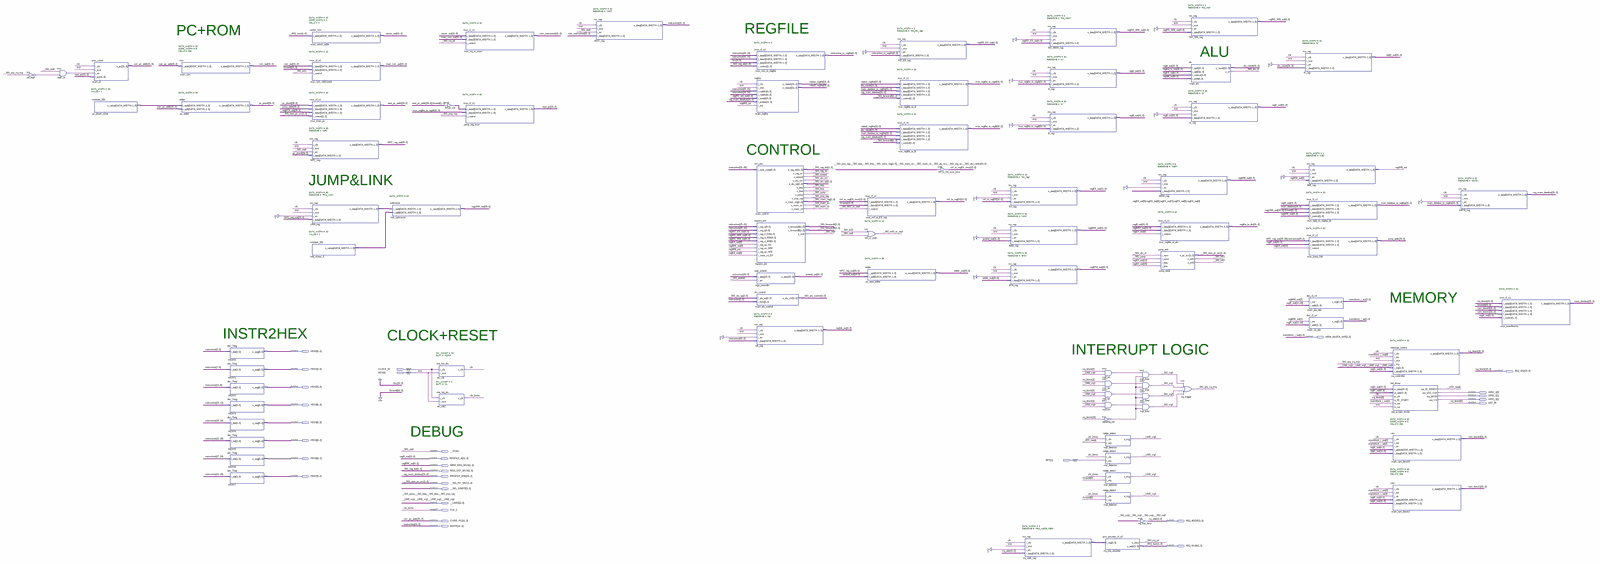
[diagram p0: schematic sheet, whole]
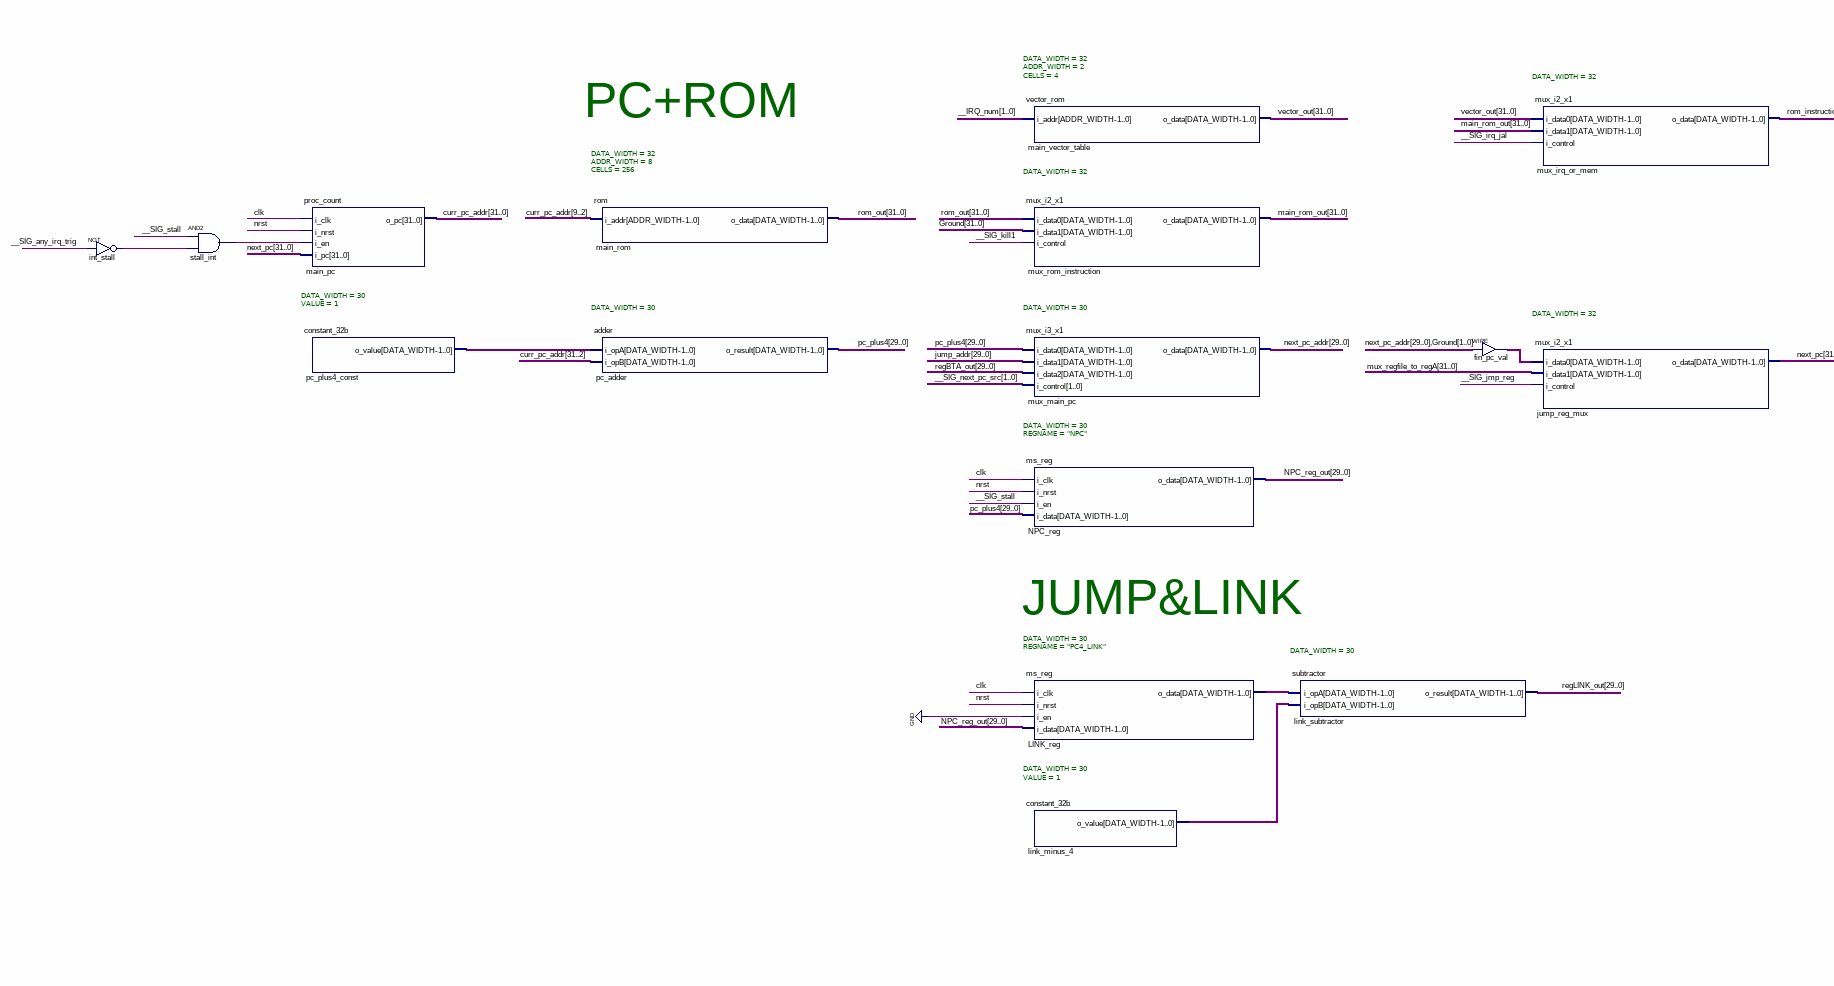
[diagram p1: schematic sheet, upper left part]
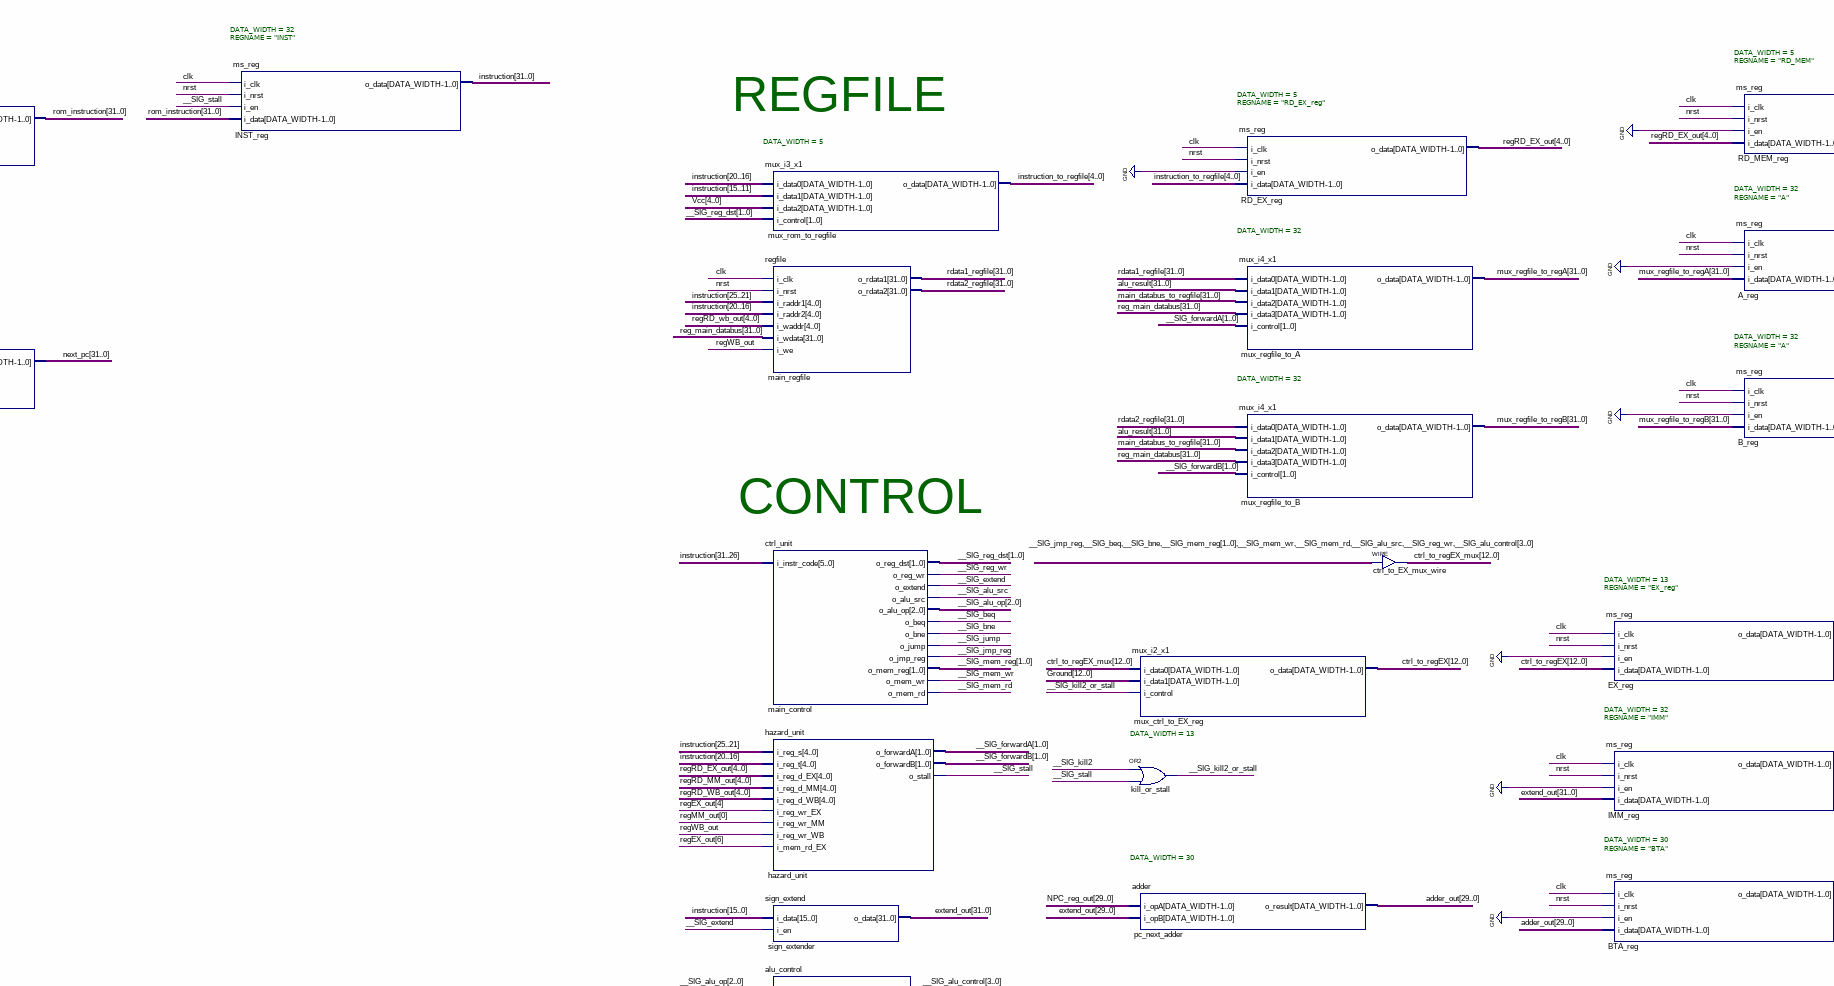
[diagram p2: schematic sheet, upper centre part]
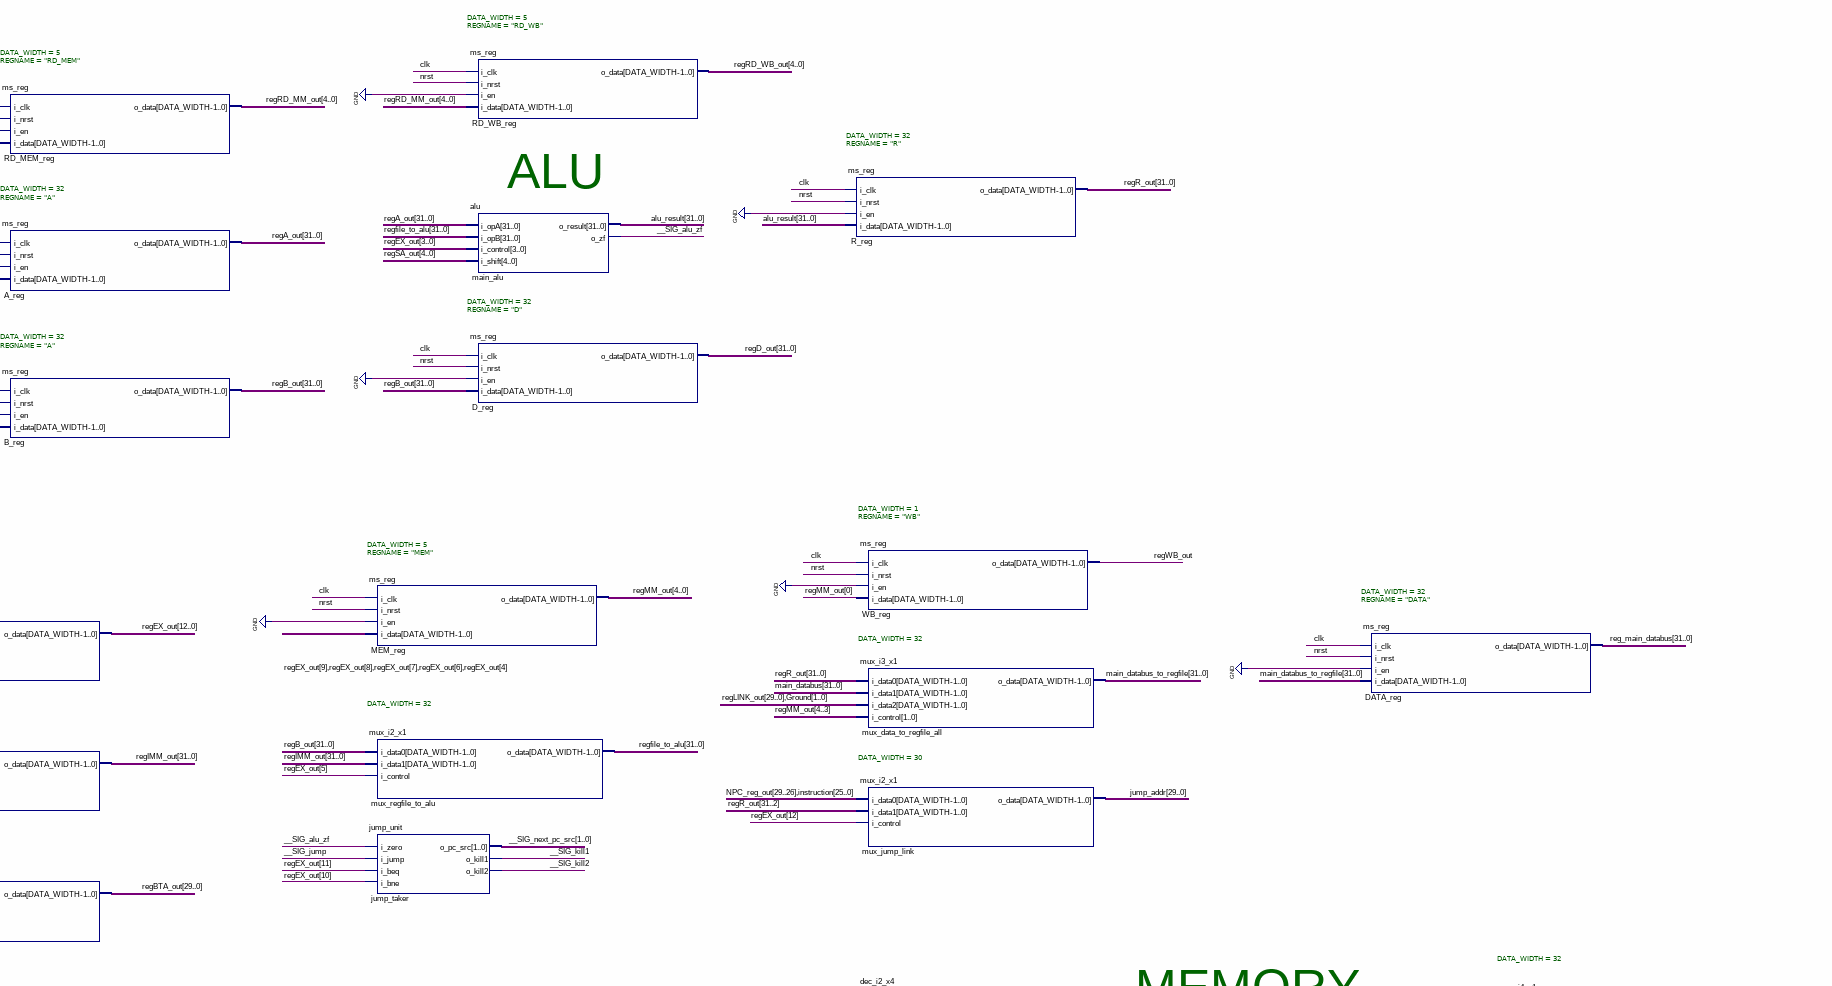
[diagram p3: schematic sheet, upper right part]
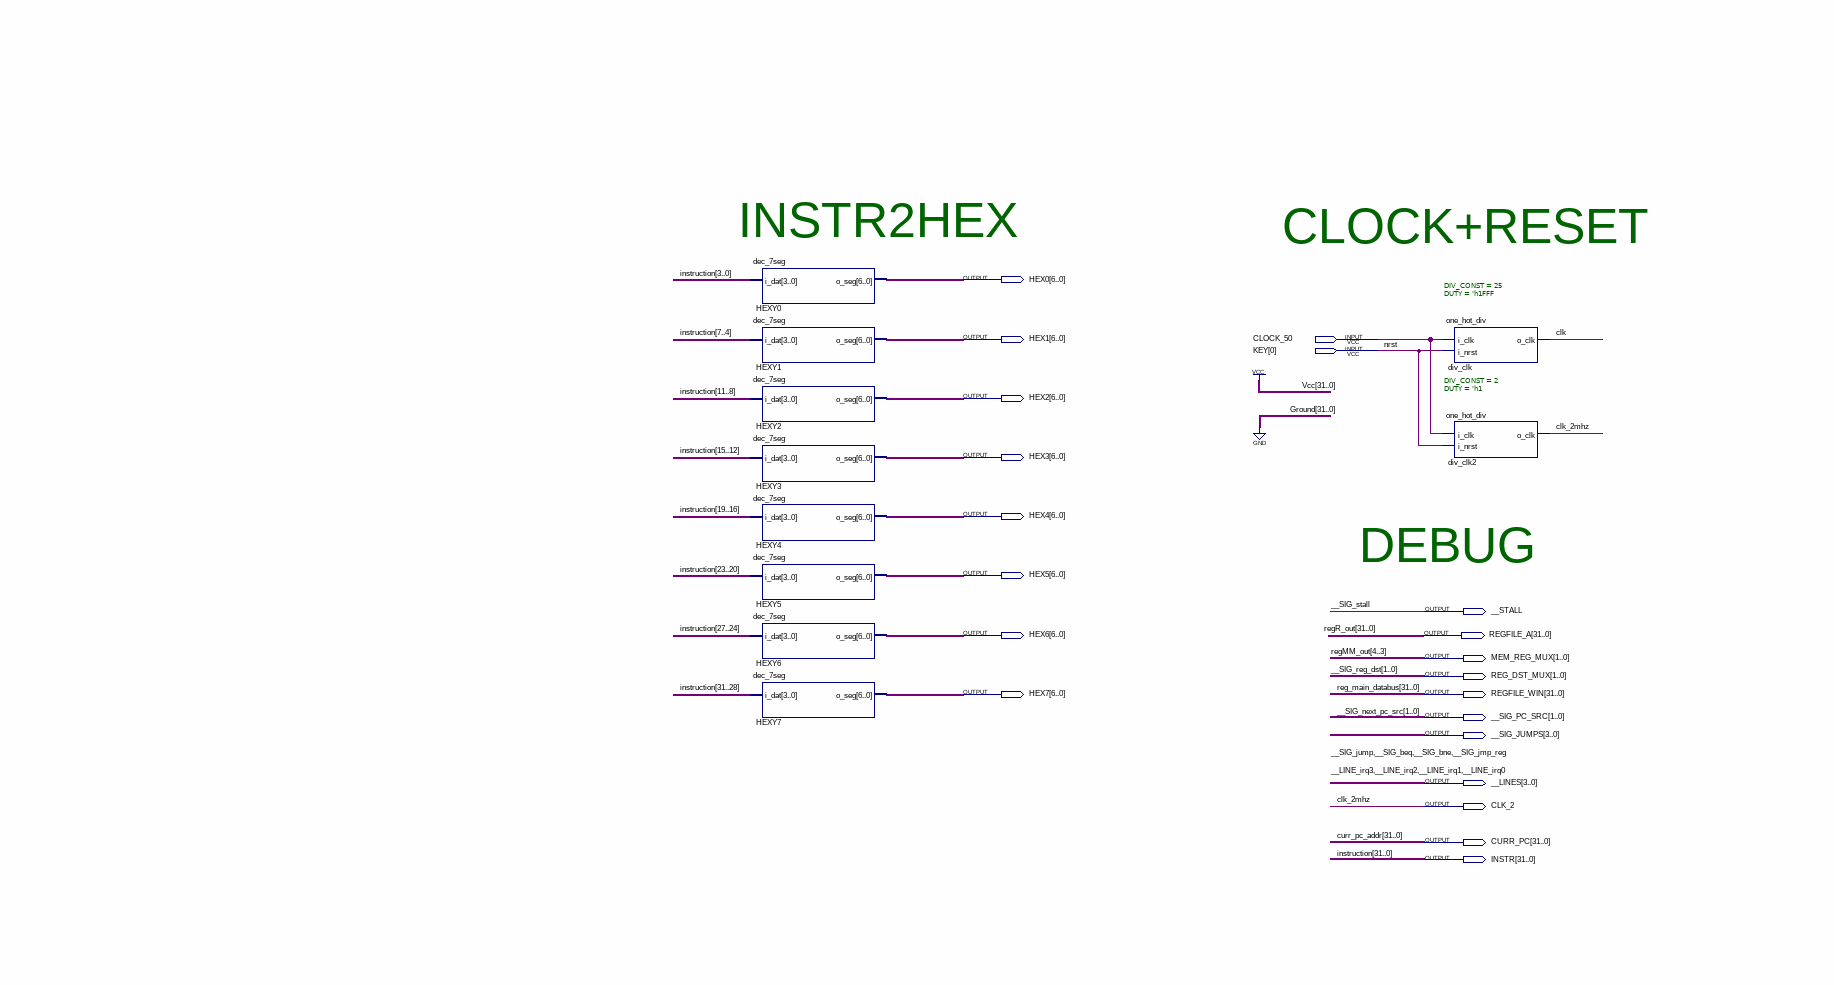
[diagram p4: schematic sheet, lower left part]
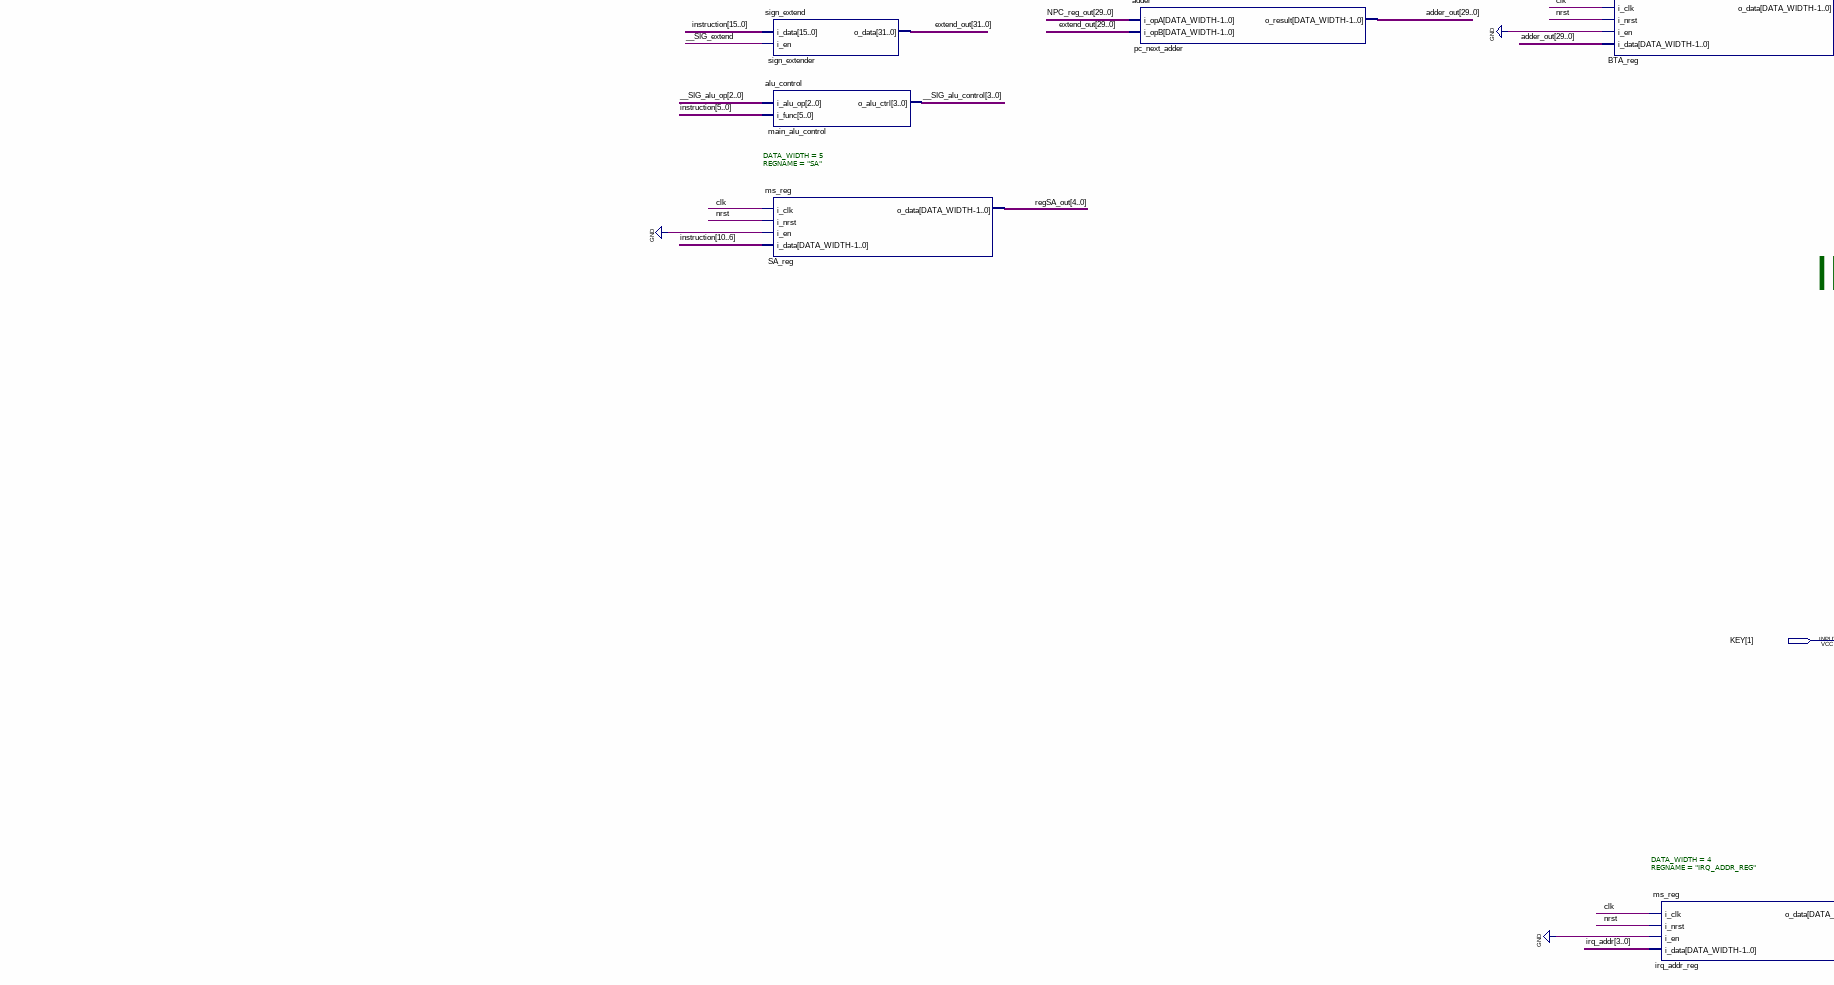
[diagram p5: schematic sheet, lower centre part]
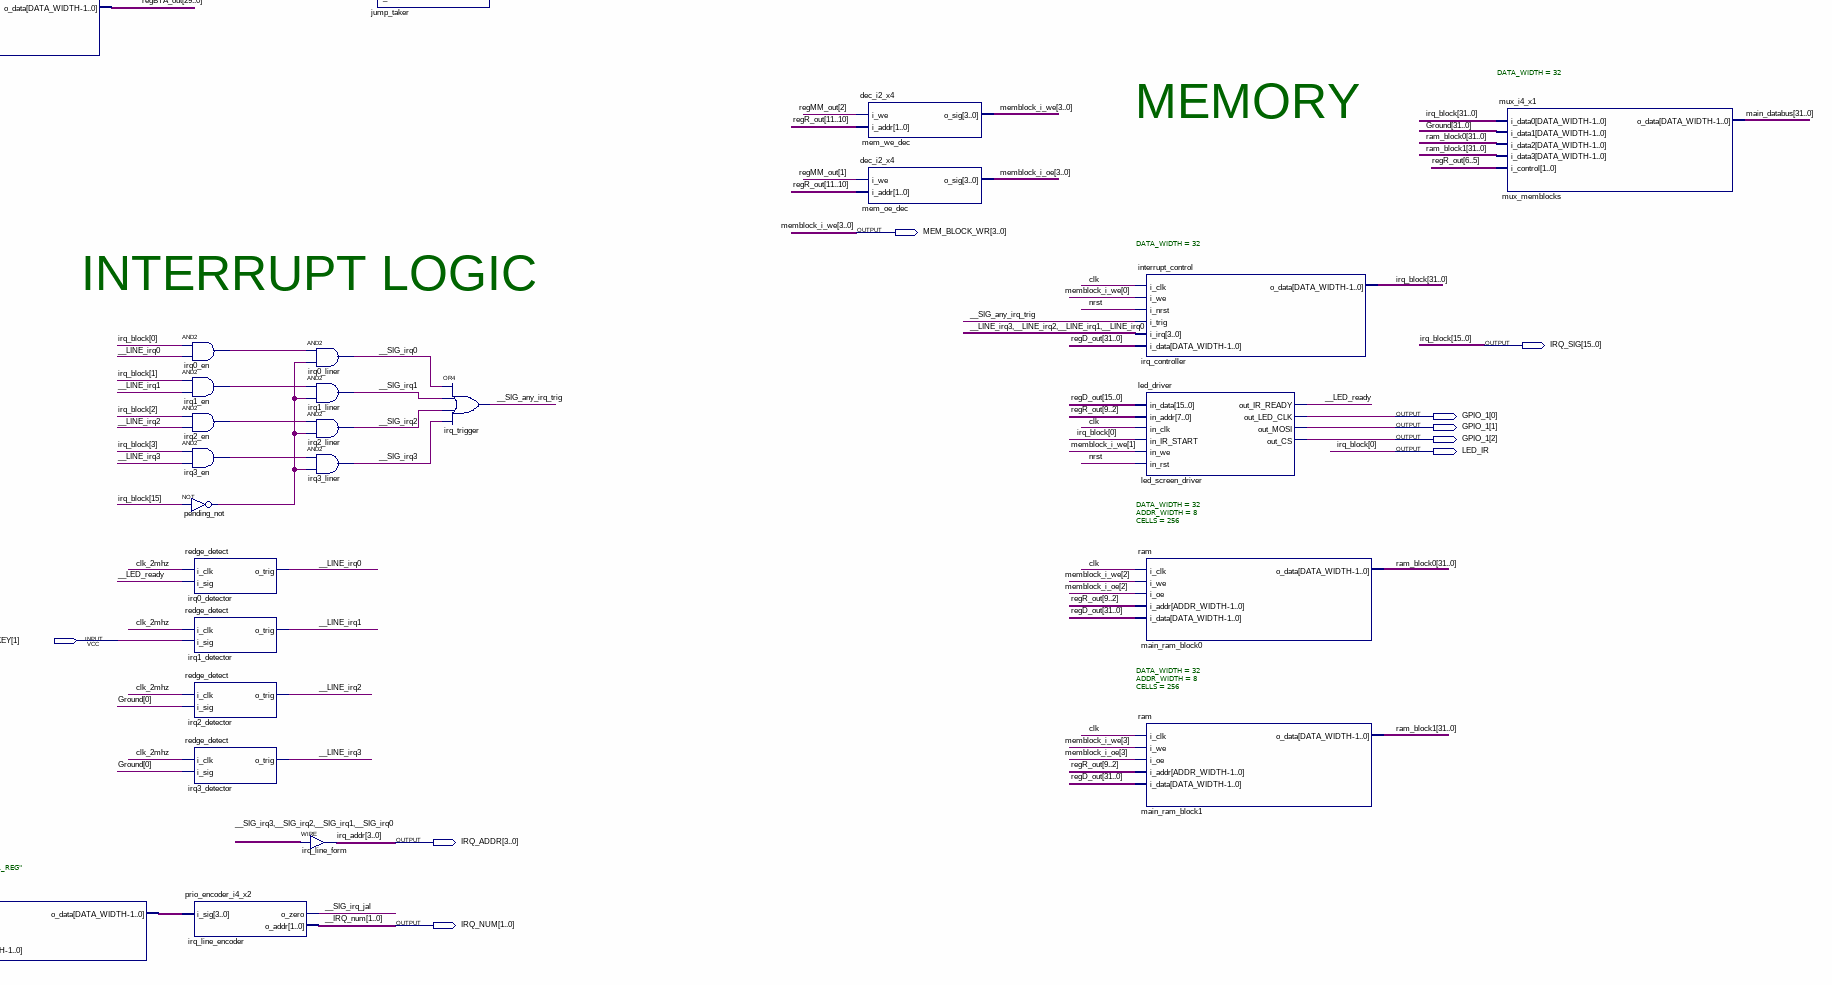
[diagram p6: schematic sheet, lower right part]
// Quartus schematic sapra_mips_graph_v1.bdf as structural Verilog: 82 symbols, 30 pins
module sapra_mips_graph_v1 (
  input  CLOCK_50,
  input  [1:0] KEY,
  output [3:0] MEM_BLOCK_WR,
  output [6:0] HEX0,
  output [6:0] HEX1,
  output [15:0] IRQ_SIG,
  output [6:0] HEX2,
  output [2:0] GPIO_1,
  output LED_IR,
  output [6:0] HEX3,
  output [6:0] HEX4,
  output [6:0] HEX5,
  output __STALL,
  output [6:0] HEX6,
  output [31:0] REGFILE_A,
  output [1:0] MEM_REG_MUX,
  output [1:0] REG_DST_MUX,
  output [6:0] HEX7,
  output [31:0] REGFILE_WIN,
  output [1:0] __SIG_PC_SRC,
  output [3:0] __SIG_JUMPS,
  output [3:0] __LINES,
  output CLK_2,
  output [31:0] CURR_PC,
  output [3:0] IRQ_ADDR,
  output [31:0] INSTR,
  output [1:0] IRQ_NUM
);

  wire __LED_ready, __SIG_alu_src, __SIG_alu_zf, __SIG_any_irq_trig, __SIG_extend, __SIG_irq0, __SIG_irq1,
       __SIG_irq2, __SIG_irq3, __SIG_irq_jal, __SIG_kill1, __SIG_kill2, __SIG_kill2_or_stall, __SIG_mem_rd,
       __SIG_mem_wr, __SIG_reg_wr, clk, int_stall_out, irq0_en_out, irq1_en_out, irq2_en_out, irq3_en_out,
       pending_not_out, regWB_out, stall_int_out;
  wire [1:0] __SIG_forwardA, __SIG_forwardB, __SIG_mem_reg;
  wire [2:0] __SIG_alu_op, regMM_out;
  wire [3:0] __SIG_alu_control, irq_addr_reg_o_data, memblock_i_oe;
  wire [4:0] instruction_to_regfile, regRD_EX_out, regRD_MM_out, regRD_wb_out, regSA_out;
  wire [12:0] ctrl_to_regEX, ctrl_to_regEX_mux, regEX_out;
  wire [29:0] adder_out, jump_addr, link_minus_4_o_value, LINK_reg_o_data, next_pc_addr, NPC_reg_out,
       pc_plus4, pc_plus4_const_o_value, regBTA_out, regLINK_out;
  wire [31:0] alu_result, extend_out, fin_pc_val_out, main_databus, main_databus_to_regfile, main_rom_out,
       mux_regfile_to_regA, mux_regfile_to_regB, next_pc, ram_block0, ram_block1, rdata1_regfile,
       rdata2_regfile, regA_out, regB_out, regD_out, regfile_to_alu, regIMM_out, rom_instruction, rom_out,
       vector_out;
  wire [31:16] irq_block;

  not int_stall (int_stall_out, __SIG_any_irq_trig);
  and stall_int (stall_int_out, __STALL, int_stall_out);
  proc_count main_pc (.i_clk(clk), .i_nrst(KEY[0]), .i_en(stall_int_out), .i_pc(next_pc), .o_pc(CURR_PC));
  constant_32b #(.DATA_WIDTH(30), .VALUE(1)) pc_plus4_const (.o_value(pc_plus4_const_o_value));
  rom #(.DATA_WIDTH(32), .ADDR_WIDTH(8), .CELLS(256)) main_rom (.i_addr(CURR_PC[9:2]), .o_data(rom_out));
  adder #(.DATA_WIDTH(30)) pc_adder (.i_opA(pc_plus4_const_o_value), .i_opB(CURR_PC[31:2]), .o_result(pc_plus4));
  dec_7seg HEXY0 (.i_dat(INSTR[3:0]), .o_seg(HEX0));
  dec_7seg HEXY1 (.i_dat(INSTR[7:4]), .o_seg(HEX1));
  dec_7seg HEXY2 (.i_dat(INSTR[11:8]), .o_seg(HEX2));
  dec_7seg HEXY3 (.i_dat(INSTR[15:12]), .o_seg(HEX3));
  dec_7seg HEXY4 (.i_dat(INSTR[19:16]), .o_seg(HEX4));
  dec_7seg HEXY5 (.i_dat(INSTR[23:20]), .o_seg(HEX5));
  dec_7seg HEXY6 (.i_dat(INSTR[27:24]), .o_seg(HEX6));
  dec_7seg HEXY7 (.i_dat(INSTR[31:28]), .o_seg(HEX7));
  vector_rom #(.DATA_WIDTH(32), .ADDR_WIDTH(2), .CELLS(4)) main_vector_table (.i_addr(IRQ_NUM), .o_data(vector_out));
  mux_i2_x1 #(.DATA_WIDTH(32)) mux_rom_instruction (
    .i_data0(rom_out), .i_data1({32{1'b0}}), .i_control(__SIG_kill1), .o_data(main_rom_out));
  mux_i3_x1 #(.DATA_WIDTH(30)) mux_main_pc (
    .i_data0(pc_plus4), .i_data1(jump_addr), .i_data2(regBTA_out), .i_control(__SIG_PC_SRC),
    .o_data(next_pc_addr));
  ms_reg #(.DATA_WIDTH(30), .REGNAME("NPC")) NPC_reg (
    .i_clk(clk), .i_nrst(KEY[0]), .i_en(__STALL), .i_data(pc_plus4), .o_data(NPC_reg_out));
  ms_reg #(.DATA_WIDTH(30), .REGNAME("PC4_LINK")) LINK_reg (
    .i_clk(clk), .i_nrst(KEY[0]), .i_en(1'b0), .i_data(NPC_reg_out), .o_data(LINK_reg_o_data));
  constant_32b #(.DATA_WIDTH(30), .VALUE(1)) link_minus_4 (.o_value(link_minus_4_o_value));
  subtractor #(.DATA_WIDTH(30)) link_subtractor (
    .i_opA(LINK_reg_o_data), .i_opB(link_minus_4_o_value), .o_result(regLINK_out));
  assign fin_pc_val_out = {next_pc_addr, 2'b00};  // WIRE fin_pc_val
  one_hot_div #(.DIV_CONST(25), .DUTY('h1FFF)) div_clk (.i_clk(CLOCK_50), .i_nrst(KEY[0]), .o_clk(clk));
  one_hot_div #(.DIV_CONST(2), .DUTY('h1)) div_clk2 (.i_clk(CLOCK_50), .i_nrst(KEY[0]), .o_clk(CLK_2));
  mux_i2_x1 #(.DATA_WIDTH(32)) mux_irq_or_mem (
    .i_data0(vector_out), .i_data1(main_rom_out), .i_control(__SIG_irq_jal), .o_data(rom_instruction));
  mux_i2_x1 #(.DATA_WIDTH(32)) jump_reg_mux (
    .i_data0(fin_pc_val_out), .i_data1(mux_regfile_to_regA), .i_control(__SIG_JUMPS[0]), .o_data(next_pc));
  ms_reg #(.DATA_WIDTH(32), .REGNAME("INST")) INST_reg (
    .i_clk(clk), .i_nrst(KEY[0]), .i_en(__STALL), .i_data(rom_instruction), .o_data(INSTR));
  mux_i3_x1 #(.DATA_WIDTH(5)) mux_rom_to_regfile (
    .i_data0(INSTR[20:16]), .i_data1(INSTR[15:11]), .i_data2({5{1'b1}}), .i_control(REG_DST_MUX),
    .o_data(instruction_to_regfile));
  regfile main_regfile (
    .i_clk(clk), .i_nrst(KEY[0]), .i_raddr1(INSTR[25:21]), .i_raddr2(INSTR[20:16]), .i_waddr(regRD_wb_out),
    .i_wdata(REGFILE_WIN), .i_we(regWB_out), .o_rdata1(rdata1_regfile), .o_rdata2(rdata2_regfile));
  ctrl_unit main_control (
    .i_instr_code(INSTR[31:26]), .o_reg_dst(REG_DST_MUX), .o_reg_wr(__SIG_reg_wr), .o_extend(__SIG_extend),
    .o_alu_src(__SIG_alu_src), .o_alu_op(__SIG_alu_op), .o_beq(__SIG_JUMPS[2]), .o_bne(__SIG_JUMPS[1]),
    .o_jump(__SIG_JUMPS[3]), .o_jmp_reg(__SIG_JUMPS[0]), .o_mem_reg(__SIG_mem_reg), .o_mem_wr(__SIG_mem_wr),
    .o_mem_rd(__SIG_mem_rd));
  hazard_unit hazard_unit (
    .i_reg_s(INSTR[25:21]), .i_reg_t(INSTR[20:16]), .i_reg_d_EX(regRD_EX_out), .i_reg_d_MM(regRD_MM_out),
    .i_reg_d_WB(regRD_wb_out), .i_reg_wr_EX(regEX_out[4]), .i_reg_wr_MM(regMM_out[0]),
    .i_reg_wr_WB(regWB_out), .i_mem_rd_EX(regEX_out[6]), .o_forwardA(__SIG_forwardA),
    .o_forwardB(__SIG_forwardB), .o_stall(__STALL));
  sign_extend sign_extender (.i_data(INSTR[15:0]), .i_en(__SIG_extend), .o_data(extend_out));
  alu_control main_alu_control (.i_alu_op(__SIG_alu_op), .i_func(INSTR[5:0]), .o_alu_ctrl(__SIG_alu_control));
  ms_reg #(.DATA_WIDTH(5), .REGNAME("SA")) SA_reg (
    .i_clk(clk), .i_nrst(KEY[0]), .i_en(1'b0), .i_data(INSTR[10:6]), .o_data(regSA_out));
  mux_i2_x1 #(.DATA_WIDTH(13)) mux_ctrl_to_EX_reg (
    .i_data0(ctrl_to_regEX_mux), .i_data1({13{1'b0}}), .i_control(__SIG_kill2_or_stall),
    .o_data(ctrl_to_regEX));
  or kill_or_stall (__SIG_kill2_or_stall, __SIG_kill2, __STALL);
  adder #(.DATA_WIDTH(30)) pc_next_adder (.i_opA(NPC_reg_out), .i_opB(extend_out[29:0]), .o_result(adder_out));
  ms_reg #(.DATA_WIDTH(5), .REGNAME("RD_EX_reg")) RD_EX_reg (
    .i_clk(clk), .i_nrst(KEY[0]), .i_en(1'b0), .i_data(instruction_to_regfile), .o_data(regRD_EX_out));
  mux_i4_x1 #(.DATA_WIDTH(32)) mux_regfile_to_A (
    .i_data0(rdata1_regfile), .i_data1(alu_result), .i_data2(main_databus_to_regfile), .i_data3(REGFILE_WIN),
    .i_control(__SIG_forwardA), .o_data(mux_regfile_to_regA));
  mux_i4_x1 #(.DATA_WIDTH(32)) mux_regfile_to_B (
    .i_data0(rdata2_regfile), .i_data1(alu_result), .i_data2(main_databus_to_regfile), .i_data3(REGFILE_WIN),
    .i_control(__SIG_forwardB), .o_data(mux_regfile_to_regB));
  assign ctrl_to_regEX_mux = {__SIG_JUMPS[0], __SIG_JUMPS[2:1], __SIG_mem_reg, __SIG_mem_wr, __SIG_mem_rd, __SIG_alu_src, __SIG_reg_wr, __SIG_alu_control};  // WIRE ctrl_to_EX_mux_wire
  ms_reg #(.DATA_WIDTH(13), .REGNAME("EX_reg")) EX_reg (
    .i_clk(clk), .i_nrst(KEY[0]), .i_en(1'b0), .i_data(ctrl_to_regEX), .o_data(regEX_out));
  ms_reg #(.DATA_WIDTH(32), .REGNAME("IMM")) IMM_reg (
    .i_clk(clk), .i_nrst(KEY[0]), .i_en(1'b0), .i_data(extend_out), .o_data(regIMM_out));
  ms_reg #(.DATA_WIDTH(30), .REGNAME("BTA")) BTA_reg (
    .i_clk(clk), .i_nrst(KEY[0]), .i_en(1'b0), .i_data(adder_out), .o_data(regBTA_out));
  ms_reg #(.DATA_WIDTH(4), .REGNAME("IRQ_ADDR_REG")) irq_addr_reg (
    .i_clk(clk), .i_nrst(KEY[0]), .i_en(1'b0), .i_data(IRQ_ADDR), .o_data(irq_addr_reg_o_data));
  ms_reg #(.DATA_WIDTH(5), .REGNAME("RD_MEM")) RD_MEM_reg (
    .i_clk(clk), .i_nrst(KEY[0]), .i_en(1'b0), .i_data(regRD_EX_out), .o_data(regRD_MM_out));
  ms_reg #(.DATA_WIDTH(32), .REGNAME("A")) A_reg (
    .i_clk(clk), .i_nrst(KEY[0]), .i_en(1'b0), .i_data(mux_regfile_to_regA), .o_data(regA_out));
  ms_reg #(.DATA_WIDTH(32), .REGNAME("A")) B_reg (
    .i_clk(clk), .i_nrst(KEY[0]), .i_en(1'b0), .i_data(mux_regfile_to_regB), .o_data(regB_out));
  and irq0_en (irq0_en_out, IRQ_SIG[0], __LINES[0]);
  and irq1_en (irq1_en_out, IRQ_SIG[1], __LINES[1]);
  and irq2_en (irq2_en_out, IRQ_SIG[2], __LINES[2]);
  and irq3_en (irq3_en_out, IRQ_SIG[3], __LINES[3]);
  not pending_not (pending_not_out, IRQ_SIG[15]);
  redge_detect irq0_detector (.i_clk(CLK_2), .i_sig(__LED_ready), .o_trig(__LINES[0]));
  redge_detect irq1_detector (.i_clk(CLK_2), .i_sig(KEY[1]), .o_trig(__LINES[1]));
  redge_detect irq2_detector (.i_clk(CLK_2), .i_sig(1'b0), .o_trig(__LINES[2]));
  redge_detect irq3_detector (.i_clk(CLK_2), .i_sig(1'b0), .o_trig(__LINES[3]));
  prio_encoder_i4_x2 irq_line_encoder (.i_sig(irq_addr_reg_o_data), .o_zero(__SIG_irq_jal), .o_addr(IRQ_NUM));
  and irq0_liner (__SIG_irq0, irq0_en_out, pending_not_out);
  and irq1_liner (__SIG_irq1, irq1_en_out, pending_not_out);
  and irq2_liner (__SIG_irq2, irq2_en_out, pending_not_out);
  and irq3_liner (__SIG_irq3, irq3_en_out, pending_not_out);
  assign IRQ_ADDR = {__SIG_irq3, __SIG_irq2, __SIG_irq1, __SIG_irq0};  // WIRE irq_line_form
  ms_reg #(.DATA_WIDTH(5), .REGNAME("MEM")) MEM_reg (
    .i_clk(clk), .i_nrst(KEY[0]), .i_en(1'b0), .i_data({regEX_out[9:6], regEX_out[4]}),
    .o_data({MEM_REG_MUX, regMM_out}));
  mux_i2_x1 #(.DATA_WIDTH(32)) mux_regfile_to_alu (
    .i_data0(regB_out), .i_data1(regIMM_out), .i_control(regEX_out[5]), .o_data(regfile_to_alu));
  jump_unit jump_taker (
    .i_zero(__SIG_alu_zf), .i_jump(__SIG_JUMPS[3]), .i_beq(regEX_out[11]), .i_bne(regEX_out[10]),
    .o_pc_src(__SIG_PC_SRC), .o_kill1(__SIG_kill1), .o_kill2(__SIG_kill2));
  ms_reg #(.DATA_WIDTH(5), .REGNAME("RD_WB")) RD_WB_reg (
    .i_clk(clk), .i_nrst(KEY[0]), .i_en(1'b0), .i_data(regRD_MM_out), .o_data(regRD_wb_out));
  alu main_alu (
    .i_opA(regA_out), .i_opB(regfile_to_alu), .i_control(regEX_out[3:0]), .i_shift(regSA_out),
    .o_result(alu_result), .o_zf(__SIG_alu_zf));
  ms_reg #(.DATA_WIDTH(32), .REGNAME("D")) D_reg (
    .i_clk(clk), .i_nrst(KEY[0]), .i_en(1'b0), .i_data(regB_out), .o_data(regD_out));
  or irq_trigger (__SIG_any_irq_trig, __SIG_irq0, __SIG_irq1, __SIG_irq2, __SIG_irq3);
  ms_reg #(.DATA_WIDTH(32), .REGNAME("R")) R_reg (
    .i_clk(clk), .i_nrst(KEY[0]), .i_en(1'b0), .i_data(alu_result), .o_data(REGFILE_A));
  ms_reg #(.DATA_WIDTH(1), .REGNAME("WB")) WB_reg (
    .i_clk(clk), .i_nrst(KEY[0]), .i_en(1'b0), .i_data(regMM_out[0]), .o_data(regWB_out));
  mux_i3_x1 #(.DATA_WIDTH(32)) mux_data_to_regfile_all (
    .i_data0(REGFILE_A), .i_data1(main_databus), .i_data2({regLINK_out, 2'b00}), .i_control(MEM_REG_MUX),
    .o_data(main_databus_to_regfile));
  mux_i2_x1 #(.DATA_WIDTH(30)) mux_jump_link (
    .i_data0({NPC_reg_out[29:26], INSTR[25:0]}), .i_data1(REGFILE_A[31:2]), .i_control(regEX_out[12]),
    .o_data(jump_addr));
  dec_i2_x4 mem_we_dec (.i_we(regMM_out[2]), .i_addr(REGFILE_A[11:10]), .o_sig(MEM_BLOCK_WR));
  dec_i2_x4 mem_oe_dec (.i_we(regMM_out[1]), .i_addr(REGFILE_A[11:10]), .o_sig(memblock_i_oe));
  interrupt_control #(.DATA_WIDTH(32)) irq_controller (
    .i_clk(clk), .i_we(MEM_BLOCK_WR[0]), .i_nrst(KEY[0]), .i_trig(__SIG_any_irq_trig), .i_irq(__LINES),
    .i_data(regD_out), .o_data({irq_block, IRQ_SIG}));
  led_driver led_screen_driver (
    .in_data(regD_out[15:0]), .in_addr(REGFILE_A[9:2]), .in_clk(clk), .in_IR_START(IRQ_SIG[0]),
    .in_we(MEM_BLOCK_WR[1]), .in_rst(KEY[0]), .out_IR_READY(__LED_ready), .out_LED_CLK(GPIO_1[0]),
    .out_MOSI(GPIO_1[1]), .out_CS(GPIO_1[2]));
  ram #(.DATA_WIDTH(32), .ADDR_WIDTH(8), .CELLS(256)) main_ram_block0 (
    .i_clk(clk), .i_we(MEM_BLOCK_WR[2]), .i_oe(memblock_i_oe[2]), .i_addr(REGFILE_A[9:2]), .i_data(regD_out),
    .o_data(ram_block0));
  ram #(.DATA_WIDTH(32), .ADDR_WIDTH(8), .CELLS(256)) main_ram_block1 (
    .i_clk(clk), .i_we(MEM_BLOCK_WR[3]), .i_oe(memblock_i_oe[3]), .i_addr(REGFILE_A[9:2]), .i_data(regD_out),
    .o_data(ram_block1));
  ms_reg #(.DATA_WIDTH(32), .REGNAME("DATA")) DATA_reg (
    .i_clk(clk), .i_nrst(KEY[0]), .i_en(1'b0), .i_data(main_databus_to_regfile), .o_data(REGFILE_WIN));
  mux_i4_x1 #(.DATA_WIDTH(32)) mux_memblocks (
    .i_data0({irq_block, IRQ_SIG}), .i_data1({32{1'b0}}), .i_data2(ram_block0), .i_data3(ram_block1),
    .i_control(REGFILE_A[6:5]), .o_data(main_databus));

  assign LED_IR = IRQ_SIG[0];

  // Other names for the same wires on the sheet: __IRQ_num[1:0] = IRQ_NUM; __LINE_irq0 = __LINES[0];
  //   __LINE_irq1 = __LINES[1]; __LINE_irq2 = __LINES[2]; __LINE_irq3 = __LINES[3]; __SIG_beq = __SIG_JUMPS[2];
  //   __SIG_bne = __SIG_JUMPS[1]; __SIG_jmp_reg = __SIG_JUMPS[0]; __SIG_jump = __SIG_JUMPS[3];
  //   __SIG_next_pc_src[1:0] = __SIG_PC_SRC; __SIG_reg_dst[1:0] = REG_DST_MUX; __SIG_stall = __STALL;
  //   clk_2mhz = CLK_2; curr_pc_addr[31:0] = CURR_PC; instruction[31:0] = INSTR; irq_block[15:0] = IRQ_SIG;
  //   memblock_i_we[3:0] = MEM_BLOCK_WR; nrst = KEY[0]; reg_main_databus[31:0] = REGFILE_WIN;
  //   regMM_out[4:3] = MEM_REG_MUX; regR_out[31:0] = REGFILE_A

  // Notes on the sheet:
  //   REGFILE
  //   PC+ROM
  //   ALU
  //   CONTROL
  //   JUMP&LINK
  //   MEMORY
  //   INSTR2HEX
  //   CLOCK+RESET
  //   INTERRUPT LOGIC
  //   DEBUG
endmodule
